# Altium project DCDC-Converter.PrjPcb
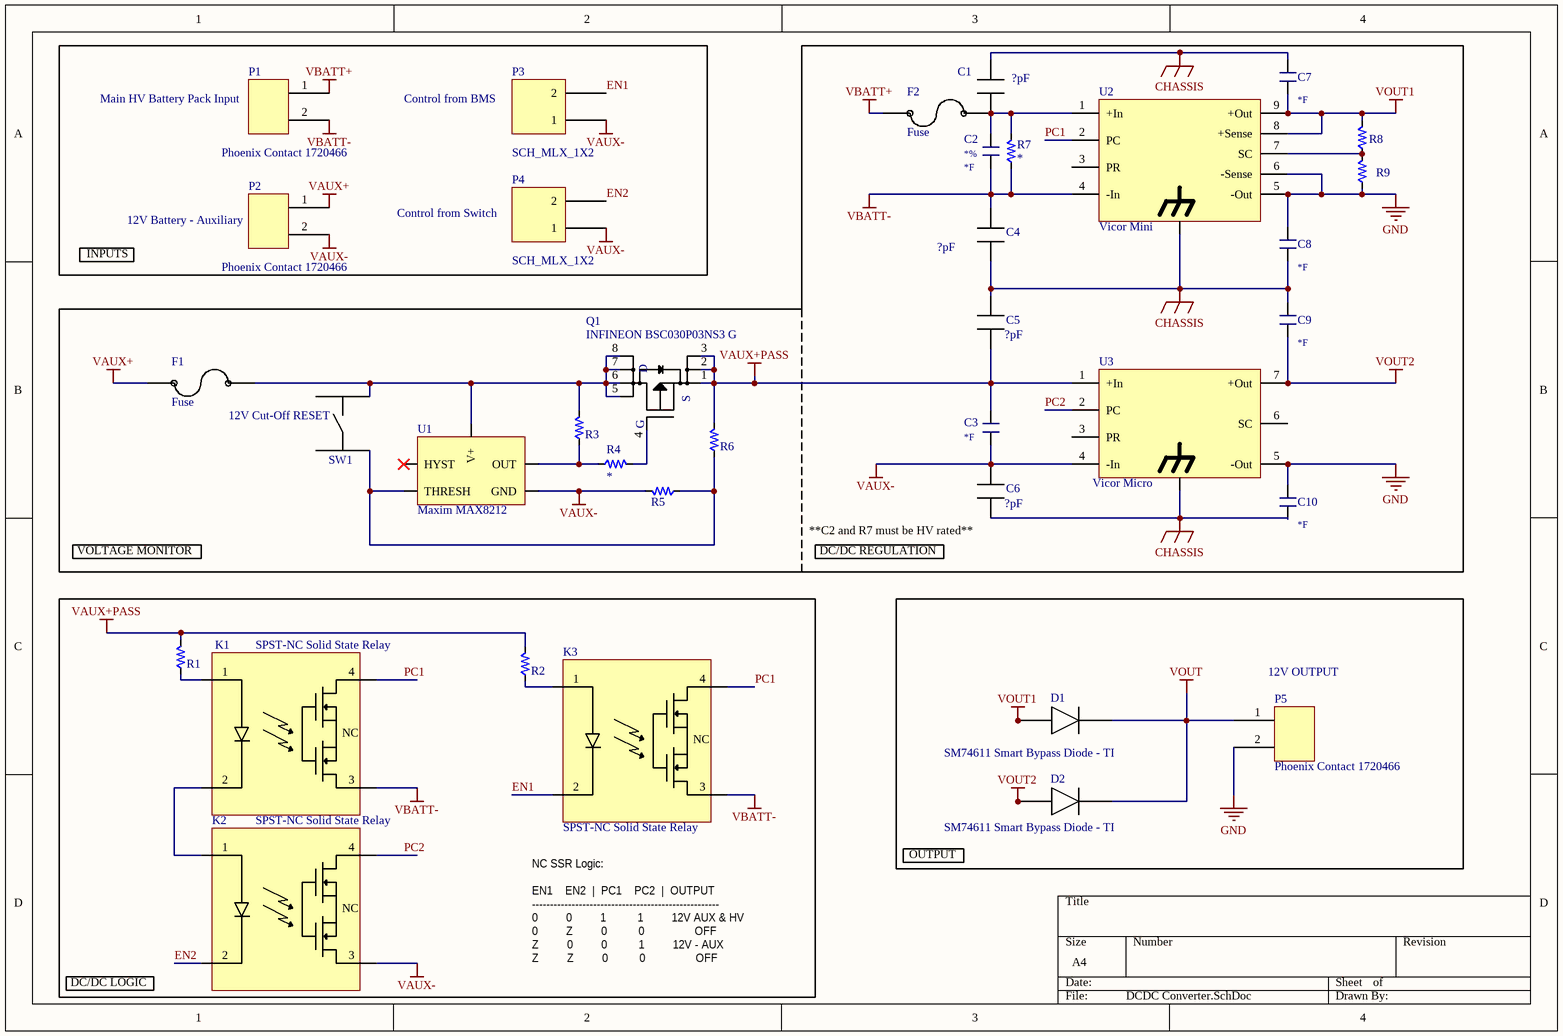
[diagram p0: DCDC Converter.SchDoc]
1 sheet, 36 parts. Net scope: global (net labels, ports and power ports of the same name join across sheets).
Board file: DCDC-Converter V1.0.PcbDoc

## Sheet DCDC Converter.SchDoc
size A4

### Parts
C1  Capacitance: ?pF  [Murata 2220 X1-Y2 Capacitor]  (hidden comment: X1-Y2 Capacitor)
C2  Tolerance: *%  Capacitance: *F  [PCB_GENERIC_CAPACITOR_1210]  (hidden comment: SCH_GENERIC_CAPACITOR_1210)
C3  Capacitance: *F  [PCB_GENERIC_SMD_0603]  (hidden comment: SCH_GENERIC_CAPACITOR_0603)
C4  Capacitance: ?pF  [Murata 2220 X1-Y2 Capacitor]  (hidden comment: X1-Y2 Capacitor)
C5  Capacitance: ?pF  [Murata 2220 X1-Y2 Capacitor]  (hidden comment: X1-Y2 Capacitor)
C6  Capacitance: ?pF  [Murata 2220 X1-Y2 Capacitor]  (hidden comment: X1-Y2 Capacitor)
C7  Capacitance: *F  [PCB_GENERIC_SMD_0603]  (hidden comment: SCH_GENERIC_CAPACITOR_0603)
C8  Capacitance: *F  [PCB_GENERIC_SMD_0603]  (hidden comment: SCH_GENERIC_CAPACITOR_0603)
C9  Capacitance: *F  [PCB_GENERIC_SMD_0603]  (hidden comment: SCH_GENERIC_CAPACITOR_0603)
C10  Capacitance: *F  [PCB_GENERIC_SMD_0603]  (hidden comment: SCH_GENERIC_CAPACITOR_0603)
D1  SM74611 Smart Bypass Diode - TI  [SM74611 Smart Bypass Diode - TI]
D2  SM74611 Smart Bypass Diode - TI  [SM74611 Smart Bypass Diode - TI]
F1  Fuse  [Schurter 5x20mm Fuse Holder]
F2  Fuse  [Schurter 5x20mm Fuse Holder]
K1  SPST-NC Solid State Relay  [SPST-NC Solid State Relay - IXYS]
K2  SPST-NC Solid State Relay  [SPST-NC Solid State Relay - IXYS]
K3  SPST-NC Solid State Relay  [SPST-NC Solid State Relay - IXYS]
P1  Phoenix Contact 1720466  [Phoenix Contact 1720466]
P2  Phoenix Contact 1720466  [Phoenix Contact 1720466]
P3  SCH_MLX_1X2  [PCB_MLX_MICROFIT_1X2]
P4  SCH_MLX_1X2  [PCB_MLX_MICROFIT_1X2]
P5  Phoenix Contact 1720466  [Phoenix Contact 1720466]
Q1  INFINEON BSC030P03NS3 G  [BSC030P03NS3 G]
R1  SCH_GENERIC_RESISTOR_0603  [PCB_GENERIC_SMD_0603]  (value not drawn)
R2  SCH_GENERIC_RESISTOR_0603  [PCB_GENERIC_SMD_0603]  (value not drawn)
R3  SCH_GENERIC_RESISTOR_0603  [PCB_GENERIC_SMD_0603]  (value not drawn)
R4  SCH_GENERIC_RESISTOR_0603  [PCB_GENERIC_SMD_0603]  (value not drawn)
R5  SCH_GENERIC_RESISTOR_0603  [PCB_GENERIC_SMD_0603]  (value not drawn)
R6  SCH_GENERIC_RESISTOR_0603  [PCB_GENERIC_SMD_0603]  (value not drawn)
R7  SCH_GENERIC_RESISTOR_1206  [PCB_GENERIC_SMD_1206]  (value not drawn)
R8  SCH_GENERIC_RESISTOR_0603  [PCB_GENERIC_SMD_0603]  (value not drawn)
R9  SCH_GENERIC_RESISTOR_0603  [PCB_GENERIC_SMD_0603]  (value not drawn)
SW1  Tactile Switch  [C&K 4 pin Tactile Switch]  (value not drawn)
U1  Maxim MAX8212  [Maxim MAX8212]
U2  Vicor Mini  [Vicor_Mini]
U3  Vicor Micro  [Vicor_Micro]

### Blocks framed on the sheet
DC/DC LOGIC: K1-K3 R1 R2

### Nets
CHASSIS: C1.2 C4.1 C5.2 C6.1 C7.2 C8.1 C9.2 C10.1 U2.0(CHASSIS_GROUND) U3.0(CHASSIS_GROUND)
GND: C8.2 C10.2 P5.2 R9.1 U2.5(-Out) U2.6(-Sense) U3.5(-Out)
VAUX+: F1.1 P2.1
VAUX+PASS: C3.2 C5.1 Q1.1(S) Q1.2(S) Q1.3(S) R1.2 R2.2 R6.2 U3.1(+In)
VAUX-: C3.1 C6.2 K2.3(Load) P2.2 P3.1 P4.1 R5.2 U1.5(GND) U3.4(-In)
VBATT+: F2.1 P1.1
VBATT-: C2.1 C4.2 K1.3(Load) K3.3(Load) P1.2 R7.1 U2.4(-In)
VOUT: D1.4 D2.4 P5.1
VOUT1: C7.1 D1.1 D1.3 R8.2 U2.8(+Sense) U2.9(+Out)
VOUT2: C9.1 D2.1 D2.3 U3.7(+Out)
EN1: K3.2(Control_-) P3.2
EN2: K2.2(Control_-) P4.2
PC1: K1.4(Load) K3.4(Load) U2.2(PC)
PC2: K2.4(Load) U3.2(PC)
NetC1_1: C1.1 C2.2 F2.2 R7.2 U2.1(+In)
NetF1_2: F1.2 Q1.5(D) Q1.6(D) Q1.7(D) Q1.8(D) R3.2 SW1.3 U1.8(V+)
NetK1_1: K1.1(Control_+) R1.1
NetK1_2: K1.2(Control_-) K2.1(Control_+)
NetK3_1: K3.1(Control_+) R2.1
NetQ1_4: Q1.4(G) R4.2
NetR3_1: R3.1 R4.1 U1.4(OUT)
NetR5_1: R5.1 R6.1 SW1.1 U1.3(THRESH)
NetR8_1: R8.1 R9.2 U2.7(SC)

Not connected (* = marked no-connect by the designer): SW1 2 4; U1 2(HYST)*; U2 3(PR); U3 3(PR) 6(SC)

### Notes on the sheet
- (near P1) Main HV Battery Pack Input
- Control from BMS
- (near P2) 12V Battery - Auxiliary
- (near P4) Control from Switch
- INPUTS
- (near SW1) 12V Cut-Off RESET
- VOLTAGE MONITOR
- (near C6) **C2 and R7 must be HV rated**
- DC/DC REGULATION
- (near P5) 12V OUTPUT
- OUTPUT
- NC SSR Logic:
  EN1    EN2  |  PC1    PC2  |  OUTPUT
  ----------------------------------------------------
  0         0         1          1         12V AUX & HV
  0         Z         0          0                OFF
  Z         0         0          1         12V - AUX
  Z         Z         0          0                OFF
- (in symbol SPST-NC Solid State Relay) NC

### Library data of the parts
C1 C4-C6 = Murata 2220 X1-Y2 Capacitor
C2 = SCH_GENERIC_CAPACITOR_1210: Generic SMD capacitor 1210
C3 C7-C10 = SCH_GENERIC_CAPACITOR_0603: Generic SMD capacitor 0603; Tolerance: *%
Q1 = BSC030P03NS3 G: P-Channel 30V 25.4A (Ta), 100A (Tc) 2.5W (Ta), 125W (Tc) Surface Mount PG-TDSON-8; Digikey Part No.: BSC030P03NS3 GCT-ND
R1-R6 R8 R9 = SCH_GENERIC_RESISTOR_0603: Generic SMD resistor 0603; Resistance: *
R7 = SCH_GENERIC_RESISTOR_1206: Generic SMD resistor 1206; Resistance: *
SW1 = C&K Tactile Switch